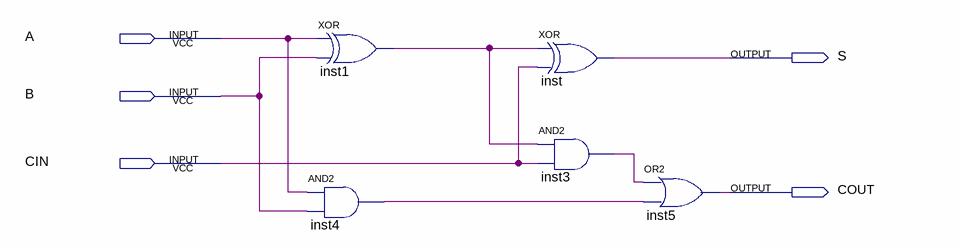
[diagram p0: schematic sheet]
// Quartus schematic ADD1.bdf as structural Verilog: 5 symbols, 5 pins
module ADD1 (
  input  A,
  input  B,
  input  CIN,
  output S,
  output COUT
);

  wire inst1_out, inst3_out, inst4_out;

  xor inst1 (inst1_out, A, B);
  and inst4 (inst4_out, A, B);
  xor inst (S, inst1_out, CIN);
  and inst3 (inst3_out, inst1_out, CIN);
  or inst5 (COUT, inst3_out, inst4_out);
endmodule
